# EAGLE design ble_clone (EAGLE 9.4.2)
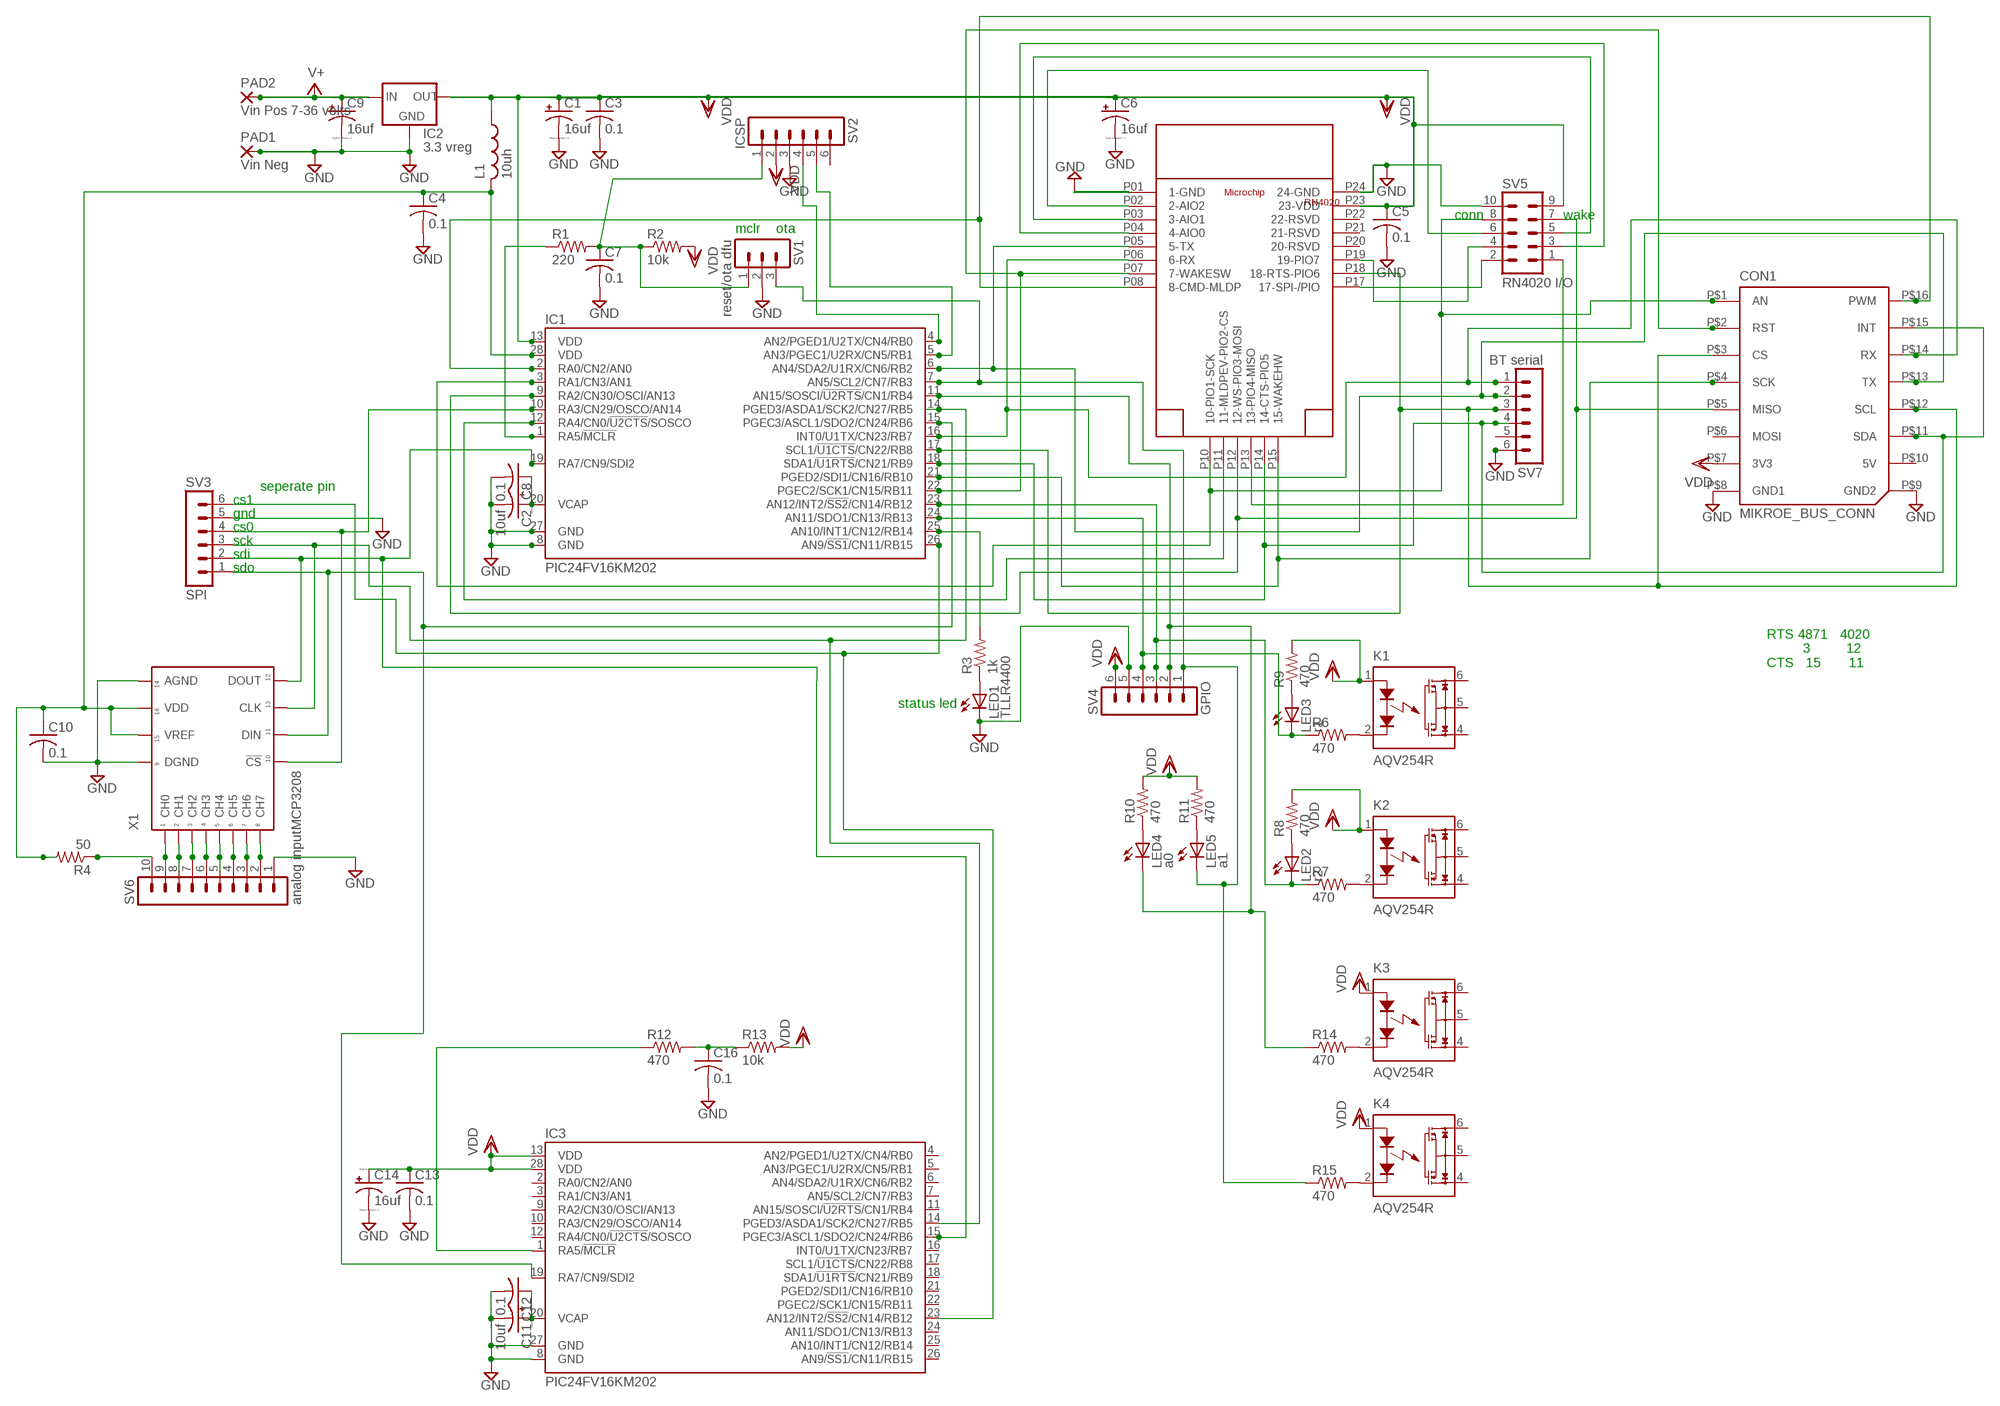
[diagram p0: schematic, sheet 1]

## Parts
C1  16uf  CPOL-USTAP5-45  [TAP5-45]
C2  10uf  CPOL-USTAP5-45  [TAP5-45]
C3  0.1  C-US025-024X044  [C025-024X044]
C4  0.1  C-US025-024X044  [C025-024X044]
C5  0.1  C-US025-024X044  [C025-024X044]
C6  16uf  CPOL-USTAP5-45  [TAP5-45]
C7  0.1  C-US025-024X044  [C025-024X044]
C8  0.1  C-US025-024X044  [C025-024X044]
C9  16uf  CPOL-USTAP5-45  [TAP5-45]
C10  0.1  C-US025-024X044  [C025-024X044]
C11  10uf  CPOL-USTAP5-45  [TAP5-45]
C12  0.1  C-USC0805  [C0805]
C13  0.1  C-USC0805  [C0805]
C14  16uf  CPOL-USTAP5-45  [TAP5-45]
C16  0.1  C-USC0805  [C0805]
CON1  MIKROE_BUS_CONN  [MIKROBUS_HOST_CONN]
IC1  PIC24FV16KM202  PIC24FVXXKA302-SP  [DIL28-3]
IC2  3.3 vreg  78XXL  [78XXL]
IC3  PIC24FV16KM202  PIC24FVXXKA302-SP  [DIL28-3]
K1  AQV254R  [DIL06]
K2  AQV254R  [DIL06]
K3  AQV254R  [DIL06]
K4  AQV254R  [DIL06]
L1  10uh  L-US0204/5  [0204/5]
LED1  TLLR4400  [LED3MM]
LED2  r2  LED3MM  [LED3MM]
LED3  r1  LED3MM  [LED3MM]
LED4  a0  LED3MM  [LED3MM]
LED5  a1  LED3MM  [LED3MM]
PAD1  Vin Neg  2,54/1,0  [2,54/1,0]
PAD2  Vin Pos 7-36 volts  2,54/1,0  [2,54/1,0]
R1  220  R-US_0204/2V  [0204V]
R2  10k  R-US_0204/2V  [0204V]
R3  1k  R-US_0204/2V  [0204V]
R4  50  R-US_0204/2V  [0204V]
R6  470  R-US_0204/2V  [0204V]
R7  470  R-US_0204/2V  [0204V]
R8  470  R-US_0204/2V  [0204V]
R9  470  R-US_0204/2V  [0204V]
R10  470  R-US_0204/2V  [0204V]
R11  470  R-US_0204/2V  [0204V]
R12  470  R-US_0204/2V  [0204V]
R13  10k  R-US_0204/2V  [0204V]
R14  470  R-US_0204/2V  [0204V]
R15  470  R-US_0204/2V  [0204V]
SV1  reset/ota dfu  MA03-1  [MA03-1]
SV2  ICSP  MA06-1  [MA06-1]
SV3  SPI  MA06-1  [MA06-1]
SV4  GPIO  MA06-1  [MA06-1]
SV5  RN4020 I/O  MA05-2  [MA05-2]
SV6  analog input  MA10-1  [MA10-1]
SV7  BT serial  MA06-1  [MA06-1]
U$1  RN4020  [RN4020SMD]
X1  MCP3208  21298EDIP  [DIP16]

## Nets
GND: C1.- C2.- C3.2 C4.2 C5.2 C6.- C7.2 C8.2 C9.- C10.2 C11.- C12.2 C13.2 C14.- C16.2 CON1.P$8(GND1) CON1.P$9(GND2) IC1.8(GND) IC1.27(GND) IC2.GND IC3.8(GND) IC3.27(GND) LED1.K(C) PAD1.1(P) SV1.2 SV2.3 SV3.5 SV4.5 SV5.10 SV6.1 SV7.6 U$1.P01(1-GND) U$1.P24(24-GND) X1.P$9(DGND) X1.P$14(AGND)
N$1: CON1.P$16(PWM) IC1.2(RA0/CN2/AN0) U$1.P08(8-CMD-MLDP)
N$2: C7.1 R1.2 R2.1 SV1.1 SV2.1
N$3: CON1.P$13(TX) IC1.6(AN4/SDA2/U1RX/CN6/RB2) SV7.2 U$1.P05(5-TX)
N$4: CON1.P$14(RX) IC1.16(INT0/U1TX/CN23/RB7) SV7.1 U$1.P06(6-RX)
N$5: CON1.P$2(RST) IC1.22(PGEC2/SCK1/CN15/RB11) U$1.P07(7-WAKESW)
N$6: IC1.1(RA5/!MCLR) R1.1
N$7: IC1.7(AN5/SCL2/CN7/RB3) LED5.K(C) R15.1 SV1.3 SV4.1
N$8: IC1.4(AN2/PGED1/U2TX/CN4/RB0) SV2.4
N$9: CON1.P$3(CS) CON1.P$12(SCL) IC1.17(SCL1/!U1CTS!/CN22/RB8) SV7.3 U$1.P18(18-RTS-PIO6)
N$10: CON1.P$11(SDA) CON1.P$15(INT) IC1.18(SDA1/!U1RTS!/CN21/RB9) SV7.4 U$1.P14(14-CTS-PIO5)
N$11: CON1.P$4(SCK) IC1.21(PGED2/SDI1/CN16/RB10) U$1.P15(15-WAKEHW)
N$12: CON1.P$5(MISO) IC1.9(RA2/CN30/OSCI/AN13) SV5.7 U$1.P12(12-WS-PIO3-MOSI)
N$13: CON1.P$1(AN) IC1.3(RA1/CN3/AN1) SV5.8 U$1.P10(10-PIO1-SCK)
N$14: IC1.12(RA4/CN0/!U2CTS!/SOSCO) U$1.P11(11-MLDPEV-PIO2-CS)
N$15: IC1.5(AN3/PGEC1/U2RX/CN5/RB1) SV2.5
N$16: C4.1 C10.1 IC1.28(VDD) L1.2 R4.2 X1.P$15(VREF) X1.P$16(VDD)
N$17: C2.+ C8.1 IC1.20(VCAP)
N$18: IC1.10(RA3/CN29/OSCO/AN14) SV3.4 X1.P$10(!CS)
N$19: IC1.19(RA7/CN9/SDI2) IC3.15(PGEC3/ASCL1/SDO2/CN24/RB6) SV3.2 X1.P$12(DOUT)
N$20: IC1.15(PGEC3/ASCL1/SDO2/CN24/RB6) IC3.19(RA7/CN9/SDI2) SV3.1 X1.P$11(DIN)
N$21: IC1.14(PGED3/ASDA1/SCK2/CN27/RB5) IC3.14(PGED3/ASDA1/SCK2/CN27/RB5) SV3.3 X1.P$13(CLK)
N$22: IC1.25(AN10/INT1/CN12/RB14) R3.2
N$23: IC1.26(AN9/!SS1!/CN11/RB15) IC3.23(AN12/INT2/!SS2!/CN14/RB12) SV3.6
N$24: IC1.11(AN15/SOSCI/!U2RTS!/CN1/RB4) LED4.K(C) R14.1 SV4.2
N$25: IC1.23(AN12/INT2/!SS2!/CN14/RB12) LED2.K(C) R7.1 SV4.3
N$26: IC1.24(AN11/SDO1/CN13/RB13) LED3.K(C) R6.1 SV4.4
N$27: LED1.A R3.1
N$28: SV5.1 U$1.P13(13-PIO4-MISO)
N$29: SV5.2 U$1.P17(17-SPI-/PIO)
N$30: SV5.4 U$1.P19(19-PIO7)
N$31: SV5.3 U$1.P04(4-AIO0)
N$32: SV5.5 U$1.P03(3-AIO1)
N$33: SV5.6 U$1.P02(2-AIO2)
N$34: SV6.2 X1.P$8(CH7)
N$35: SV6.3 X1.P$7(CH6)
N$36: SV6.4 X1.P$6(CH5)
N$37: SV6.5 X1.P$5(CH4)
N$38: SV6.6 X1.P$4(CH3)
N$39: SV6.7 X1.P$3(CH2)
N$40: SV6.8 X1.P$2(CH1)
N$41: SV6.9 X1.P$1(CH0)
N$42: C11.+ C12.1 IC3.20(VCAP)
N$43: R4.1 SV6.10
N$44: K3.2(K) R14.2
N$45: K1.2(K) R6.2
N$46: K2.2(K) R7.2
N$47: LED2.A R8.1
N$48: LED3.A R9.1
N$49: C16.1 R12.2 R13.1
N$50: IC3.1(RA5/!MCLR) R12.1
N$51: LED4.A R10.1
N$52: LED5.A R11.1
N$53: K4.2(K) R15.2
V+: C9.+ IC2.IN PAD2.1(P)
VDD: C1.+ C3.1 C5.1 C6.+ C13.1 C14.+ CON1.P$7(3V3) IC1.13(VDD) IC2.OUT IC3.13(VDD) IC3.28(VDD) K1.1(A) K2.1(A) K3.1(A) K4.1(A) L1.1 R2.2 R8.2 R9.2 R10.2 R11.2 R13.2 SV2.2 SV4.6 SV5.9 U$1.P23(23-VDD)
Unconnected: CON1.P$6(MOSI) CON1.P$10(5V) IC3.2(RA0/CN2/AN0) IC3.3(RA1/CN3/AN1) IC3.4(AN2/PGED1/U2TX/CN4/RB0) IC3.5(AN3/PGEC1/U2RX/CN5/RB1) IC3.6(AN4/SDA2/U1RX/CN6/RB2) IC3.7(AN5/SCL2/CN7/RB3) IC3.9(RA2/CN30/OSCI/AN13) IC3.10(RA3/CN29/OSCO/AN14) IC3.11(AN15/SOSCI/!U2RTS!/CN1/RB4) IC3.12(RA4/CN0/!U2CTS!/SOSCO) IC3.16(INT0/U1TX/CN23/RB7) IC3.17(SCL1/!U1CTS!/CN22/RB8) IC3.18(SDA1/!U1RTS!/CN21/RB9) IC3.21(PGED2/SDI1/CN16/RB10) IC3.22(PGEC2/SCK1/CN15/RB11) IC3.24(AN11/SDO1/CN13/RB13) IC3.25(AN10/INT1/CN12/RB14) IC3.26(AN9/!SS1!/CN11/RB15) K1.4(D2) K1.5(S) K1.6(D1) K2.4(D2) K2.5(S) K2.6(D1) K3.4(D2) K3.5(S) K3.6(D1) K4.4(D2) K4.5(S) K4.6(D1) SV2.6 SV7.5 U$1.P20(20-RSVD) U$1.P21(21-RSVD) U$1.P22(22-RSVD)

## Notes on the sheet
- conn | wake
- mclr | ota
- seperate pin
- cs1
- gnd
- cs0
- sck
- sdi
- sdo
- RTS 4871   4020
           3         12
  CTS   15       11
- status led

## Library data of the parts
C1 C2 C6 C9 C11 C14 = resistor:CPOL-US: POLARIZED CAPACITOR, American symbol
C3-C5 C7 C8 C10 = resistor:C-US: CAPACITOR, American symbol
C12 C13 C16 = rcl:C-US: CAPACITOR, American symbol; SPICEPREFIX: C
CON1 = mikrobus_lib:MIKROE_BUS_CONN
IC1 IC3 = pic24kakl:PIC24FVXXKA302: PIC24FVXXKA302 2.0-5.5V 28 pin
IC2 = v-reg:78XXL: VOLTAGE REGULATOR
K1-K4 = relay:AQV254R: PhotoMOS Relay NAiS Source: http://www.mew-europe.com/.. pti_en.pdf; MF: AROMAT/ MATSUSHITA; MPN: AQV254; OC_FARNELL: 1124063; OC_NEWARK: 93F6300
L1 = resistor:L-US: INDUCTOR, American symbol
LED1 = led:TLLR4400: Low Current (2mA) LED 3 mm Tinted Diffused Package color RED Source: Data sheet <http://www.farnell.com/datasheets/391100.pdf>; MF: VISHAY SEMICONDUCTOR; OC_FARNELL: 1612437
LED2-LED5 = led:LED: LED OSRAM: - CHIPLED LG R971, LG N971, LY N971, LG Q971, LY Q971, LO R971, LY R971 LH N974, LH R974 LS Q976, LO Q976, LY Q976 LO Q996 - Hyper CHIPLED LW Q18S LB Q993, LB Q99A, LB R99A - SideLED LS A670, LO A670, LY A670, LG A670, LP A670 LB A673, LV A673, LT A673, LW A673 LH A674 LY A675 LS A676, LA A676, LO A676, LY A676, LW A676 LS A679, LY A679, LG A679 - Hyper Micro SIDELED® LS Y876, LA Y876, LO Y876, LY Y876 LT Y87S - SmartLED LW L88C, LW L88S LB L89C, LB L89S, LG L890 LS L89K, LO L89K, LY L89K LS L896, LA L896, LO L896, LY L896 - TOPLED LS T670, LO T670, LY T670, LG T670, LP T670 LSG T670, LSP T670, LSY T670, LOP T670, LYG T670 LG T671, LOG T671, LSG T671 LB T673, LV T673, LT T673, LW T673 LH T674 LS T676, LA T676, LO T676, LY T676, LB T676, LH T676, LSB T676, LW T676 LB T67C, LV T67C, LT T67C, LS T67K, LO T67K, LY T67K, LW E67C LS E67B, LA E67B, LO E67B, LY E67B, LB E67C, LV E67C, LT E67C LW T67C LS T679, LY T679, LG T679 LS T770, LO T770, LY T770, LG T770, LP T770 LB T773, LV T773, LT T773, LW T773 LH T774 LS E675, LA E675, LY E675, LS T675 LS T776, LA T776, LO T776, LY T776, LB T776 LHGB T686 LT T68C, LB T68C - Hyper Mini TOPLED® LB M676 - Mini TOPLED Santana® LG M470 LS M47K, LO M47K, LY M47K Source: http://www.osram.convergy.de LUXEON: - LUMILED® LXK2-PW12-R00, LXK2-PW12-S00, LXK2-PW14-U00, LXK2-PW14-V00 LXK2-PM12-R00, LXK2-PM12-S00, LXK2-PM14-U00 LXK2-PE12-Q00, LXK2-PE12-R00, LXK2-PE12-S00, LXK2-PE14-T00, LXK2-PE14-U00 LXK2-PB12-K00, LXK2-PB12-L00, LXK2-PB12-M00, LXK2-PB14-N00, LXK2-PB14-P00, LXK2-PB14-Q00 LXK2-PR12-L00, LXK2-PR12-M00, LXK2-PR14-Q00, LXK2-PR14-R00 LXK2-PD12-Q00, LXK2-PD12-R00, LXK2-PD12-S00 LXK2-PH12-R00, LXK2-PH12-S00 LXK2-PL12-P00, LXK2-PL12-Q00, LXK2-PL12-R00 Source: www.luxeon.com KINGBRIGHT: KA-3528ASYC Source: www.kingbright.com
PAD1 PAD2 = wirepad:2,54/1,0: THROUGH-HOLE PAD
R1-R4 R6-R15 = resistor:R-US_: RESISTOR, American symbol
SV1 = con-lstb:MA03-1: PIN HEADER; OC_FARNELL: unknown; OC_NEWARK: unknown
SV2-SV4 SV7 = con-lstb:MA06-1: PIN HEADER; OC_FARNELL: unknown; OC_NEWARK: unknown
SV5 = con-lstb:MA05-2: PIN HEADER; OC_FARNELL: unknown; OC_NEWARK: unknown
SV6 = con-lstb:MA10-1: PIN HEADER; OC_FARNELL: unknown; OC_NEWARK: unknown
U$1 = microchip_bluetooth_v101:RN4020
X1 = Microchip:21298E

## Board
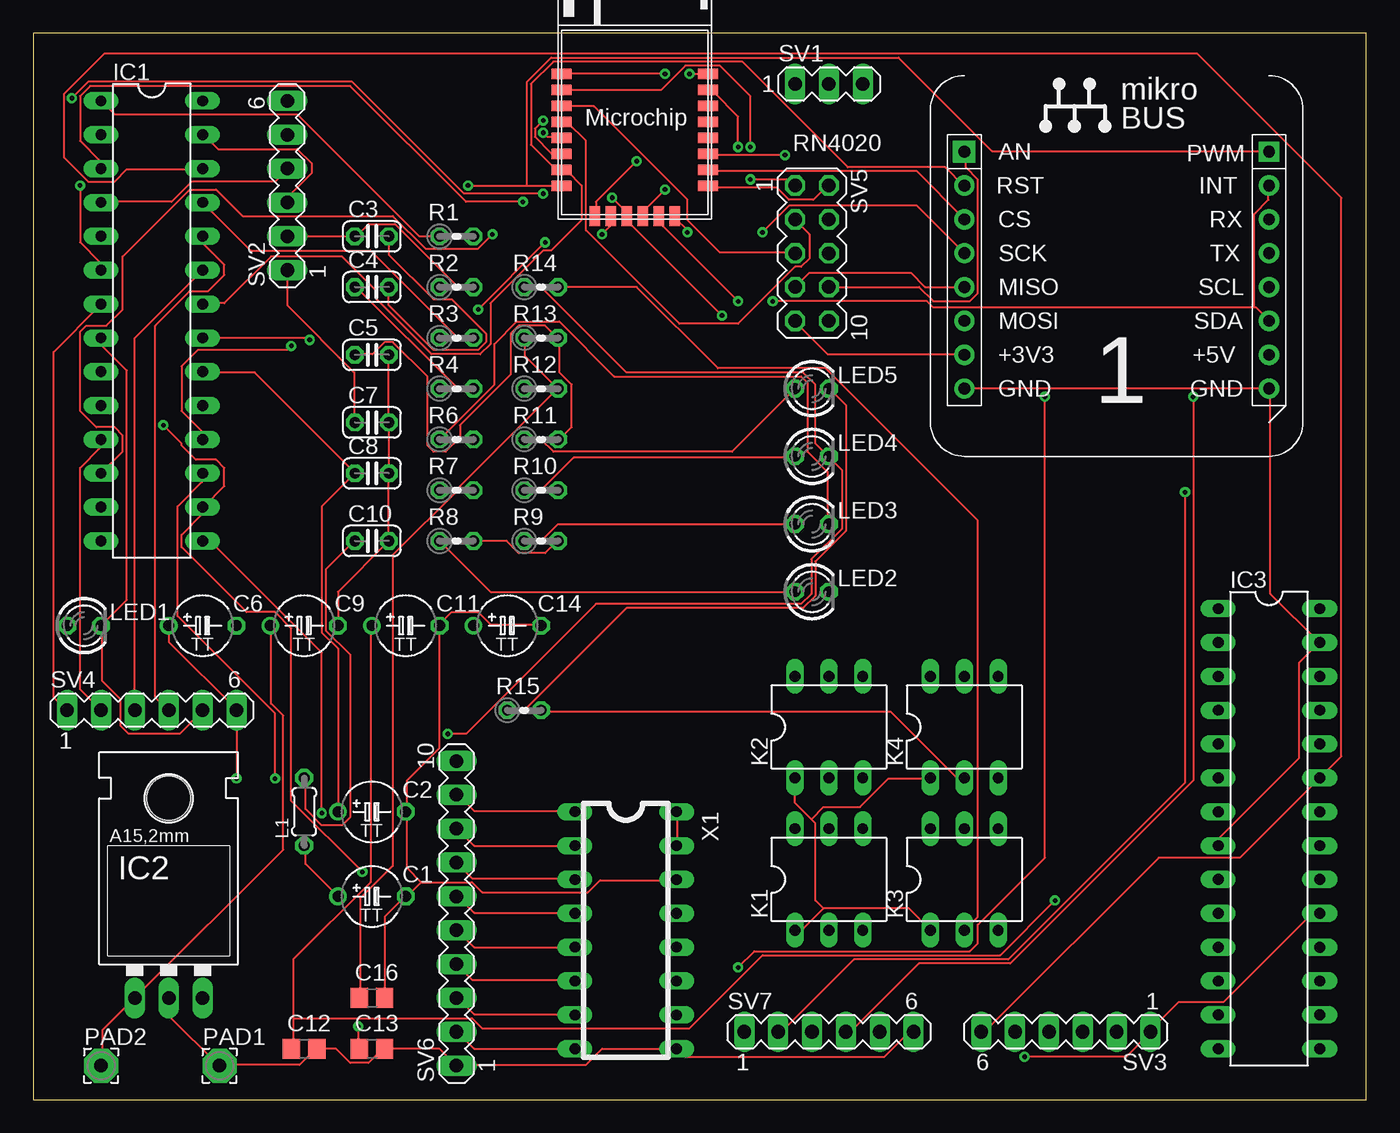
[diagram p1: board, top side]
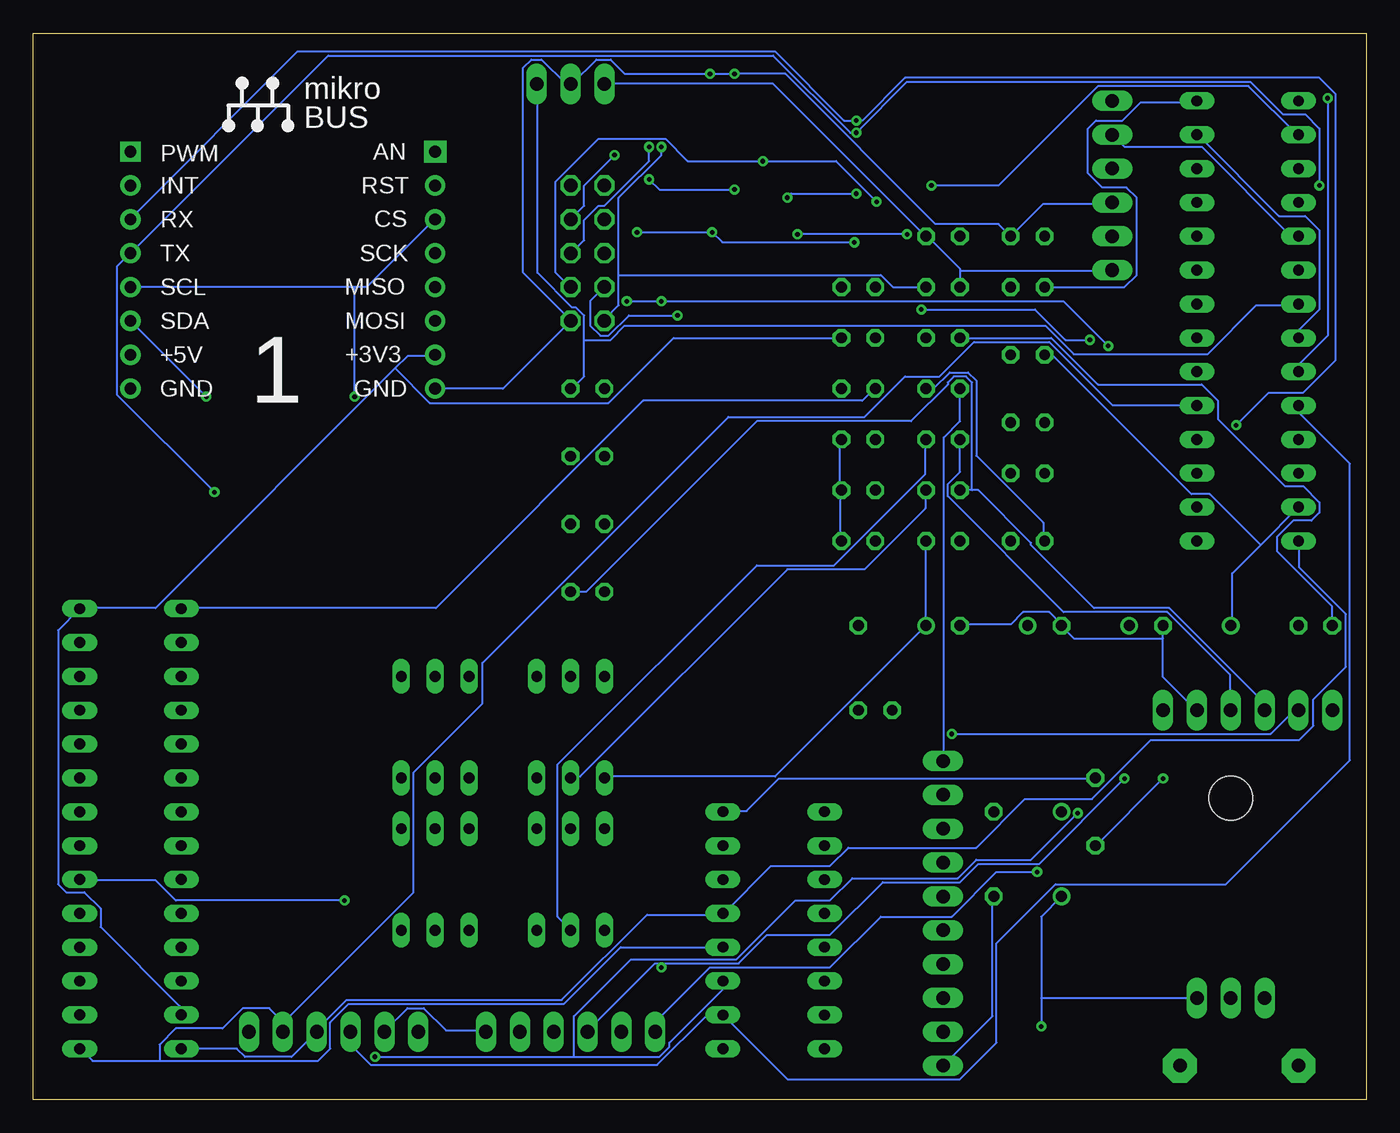
[diagram p2: board, bottom side, seen from below]

Size 100 x 80 mm. Coordinates in mm from the lower left corner, seen from the top.
Outline: 0,0 100,0 100,80 0,80 0,0
Copper layers (1*16): Top 0.035mm / dielectric 1.5mm / Bottom 0.035mm
Design rules "default": minimum track width 6mil, minimum drill 0.35mm, track to track 6mil, track to pad 6mil, pad to pad 6mil, via to via 6mil, smd to smd 6mil, copper to edge 40mil, drill to drill 6mil, minimum pad ring 10mil, minimum via ring 8mil, stop-mask expansion 4mil, vias tented up to drill 0mil, thermal gap 10mil

### Footprints (pad centres in the part's own frame; a part is rotated, then mirrored left to right if it is on the bottom)
TAP5-45 = drill 0.813: + -2.54,0 | drill 0.813 octagon: - 2.54,0
C025-024X044 = drill 0.813 octagon: 1 -1.27,0; 2 1.27,0
C0805 = smd 1.3 x 1.5: 1 -0.95,0; 2 0.95,0
MIKROBUS_HOST_CONN = drill 0.889 pad 1.676 square: P$1 0,0 | drill 0.889 pad 1.524: P$2 0,-2.54; P$3 0,-5.08; P$4 0,-7.62; P$5 0,-10.16; P$6 0,-12.7; P$7 0,-15.24; P$8 0,-17.78; P$9 22.86,-17.78; P$10 22.86,-15.24; P$11 22.86,-12.7; P$12 22.86,-10.16; P$13 22.86,-7.62; P$14 22.86,-5.08; P$15 22.86,-2.54 | drill 0.889 pad 1.524 square: P$16 22.86,0
DIL28-3 = drill 0.813 long: 1 -16.51,-3.81; 2 -13.97,-3.81; 3 -11.43,-3.81; 4 -8.89,-3.81; 5 -6.35,-3.81; 6 -3.81,-3.81; 7 -1.27,-3.81; 8 1.27,-3.81; 9 3.81,-3.81; 10 6.35,-3.81; 11 8.89,-3.81; 12 11.43,-3.81; 13 13.97,-3.81; 14 16.51,-3.81; 15 16.51,3.81; 16 13.97,3.81; 17 11.43,3.81; 18 8.89,3.81; 19 6.35,3.81; 20 3.81,3.81; 21 1.27,3.81; 22 -1.27,3.81; 23 -3.81,3.81; 24 -6.35,3.81; 25 -8.89,3.81; 26 -11.43,3.81; 27 -13.97,3.81; 28 -16.51,3.81
78XXL = drill 1.016 long: GND 0,-3.81; IN -2.54,-3.81; OUT 2.54,-3.81 | hole 3.302: 0,11.176
DIL06 = drill 0.813 long: 1 -2.54,-3.81; 2 0,-3.81; 3 2.54,-3.81; 4 2.54,3.81; 5 0,3.81; 6 -2.54,3.81
0204/5 = drill 0.813 octagon: 1 -2.54,0; 2 2.54,0
LED3MM = drill 0.813 octagon: A -1.27,0; K 1.27,0
2,54/1,0 = drill 1.016 pad 2.54 octagon: 1 0,0
0204V = drill 0.813 octagon: 1 -1.27,0; 2 1.27,0
MA03-1 = drill 1.016 long: 1 -2.54,0; 2 0,0; 3 2.54,0
MA06-1 = drill 1.016 long: 1 -6.35,0; 2 -3.81,0; 3 -1.27,0; 4 1.27,0; 5 3.81,0; 6 6.35,0
MA05-2 = drill 1.016 octagon: 1 -5.08,-1.27; 2 -5.08,1.27; 3 -2.54,-1.27; 4 -2.54,1.27; 5 0,-1.27; 6 0,1.27; 7 2.54,-1.27; 8 2.54,1.27; 9 5.08,-1.27; 10 5.08,1.27
MA10-1 = drill 1.016 long: 1 -11.43,0; 2 -8.89,0; 3 -6.35,0; 4 -3.81,0; 5 -1.27,0; 6 1.27,0; 7 3.81,0; 8 6.35,0; 9 8.89,0; 10 11.43,0
RN4020SMD = smd 1.5 x 0.8: P01 0.25,10.9; P02 0.25,9.7; P03 0.25,8.5; P04 0.25,7.3; P05 0.25,6.1; P06 0.25,4.9; P07 0.25,3.7; P08 0.25,2.5; P17 11.25,2.5; P18 11.25,3.7; P19 11.25,4.9; P20 11.25,6.1; P21 11.25,7.3; P22 11.25,8.5; P23 11.25,9.7; P24 11.25,10.9 | smd 0.8 x 1.5: P10 2.75,0.25; P11 3.95,0.25; P12 5.15,0.25; P13 6.35,0.25; P14 7.55,0.25; P15 8.75,0.25
DIP16 = drill 0.8 long: P$1 -10.16,-3.81; P$2 -7.62,-3.81; P$3 -5.08,-3.81; P$4 -2.54,-3.81; P$5 0,-3.81; P$6 2.54,-3.81; P$7 5.08,-3.81; P$8 7.62,-3.81; P$9 7.62,3.81; P$10 5.08,3.81; P$11 2.54,3.81; P$12 0,3.81; P$13 -2.54,3.81; P$14 -5.08,3.81; P$15 -7.62,3.81; P$16 -10.16,3.81

### Placement (x,y rotation side)
C1  25.4,15.24 0 top
C2  25.4,21.59 0 top
C3  25.4,64.77 0 top
C4  25.4,60.96 0 top
C5  25.4,55.88 0 top
C6  12.7,35.56 0 top
C7  25.4,50.8 0 top
C8  25.4,46.99 0 top
C9  20.32,35.56 0 top
C10  25.4,41.91 0 top
C11  27.94,35.56 0 top
C12  20.32,3.81 0 top
C13  25.4,3.81 0 top
C14  35.56,35.56 0 top
C16  25.4,7.62 0 top
CON1  69.85,71.12 0 top
IC1  8.89,58.42 270 top
IC2  10.16,11.43 0 top
IC3  92.71,20.32 270 top
K1  59.69,16.51 0 top
K2  59.69,27.94 0 top
K3  69.85,16.51 0 top
K4  69.85,27.94 0 top
L1  20.32,21.59 90 top
LED1  3.81,35.56 0 top
LED2  58.42,38.1 0 top
LED3  58.42,43.18 0 top
LED4  58.42,48.26 0 top
LED5  58.42,53.34 0 top
PAD1  13.97,2.54 0 top
PAD2  5.08,2.54 0 top
R1  31.75,64.77 0 top
R2  31.75,60.96 0 top
R3  31.75,57.15 0 top
R4  31.75,53.34 0 top
R6  31.75,49.53 0 top
R7  31.75,45.72 0 top
R8  31.75,41.91 0 top
R9  38.1,41.91 0 top
R10  38.1,45.72 0 top
R11  38.1,49.53 0 top
R12  38.1,53.34 0 top
R13  38.1,57.15 0 top
R14  38.1,60.96 0 top
R15  36.83,29.21 0 top
SV1  59.69,76.2 0 top
SV2  19.05,68.58 90 top
SV3  77.47,5.08 180 top
SV4  8.89,29.21 0 top
SV5  58.42,63.5 270 top
SV6  31.75,13.97 90 top
SV7  59.69,5.08 0 top
U$1  39.37,66.04 0 top
X1  44.45,11.43 270 top

### Tracks (layer width: path | path; a pad name or v marks a point on that pad's centre or on a via)
GND  (via drill 0.35)
  Top 0.152: v47.4,76.96 39.62,76.96 U$1.P01 | v49.23,76.96 50.6,76.96 U$1.P24 | 96.47,34.29 94.94,32.77 94.94,25.6 89,19.66 89,19.05 IC3.8 | 96.47,34.29 92.81,37.95 92.81,53.34 CON1.P$9 CON1.P$8 | 96.47,34.29 IC3.27 | C4.2 26.67,59.59 30.02,56.24 33.38,56.24 33.98,56.84 33.98,57.45 31.39,60.05 30.02,60.05 26.67,63.4 C3.2 | SV2.3 19.05,67.67 20.88,69.49 20.88,70.26 19.81,71.32 13.87,71.32 12.8,72.39 IC1.27 | SV4.5 12.65,29.11 10.97,27.43 7.16,27.43 6.55,28.04 6.55,30.02 5.18,31.39 5.18,35.51 LED1.K 7.01,37.49 7.01,54.71 5.18,56.54 5.18,57.15 IC1.8 | C5.2 C7.2 C8.2 C10.2 22.86,38.1 C9.- | C14.- 38.1,35.66 34.29,35.66 33.38,36.58 31.39,36.58 30.48,35.66 C11.- 30.48,26.36 28.04,23.93 28.04,21.64 C2.- 28.04,21.49 28.04,17.37 29.11,16.31 | C16.2 26.36,7.62 26.36,13.72 27.89,15.24 C1.- 28.04,15.24 29.11,16.31 | 29.11,16.31 32.92,16.31 33.68,15.54 41.6,15.54 42.52,16.46 48.16,16.46 X1.P$14 | IC2.GND 10.21,7.62 10.21,6.25 13.87,2.59 PAD1.1 14.02,2.59 19.96,2.59 21.18,3.81 C12.2 22.71,3.81 23.77,2.74 25.15,2.74 26.21,3.81 C13.2 30.48,3.81 SV6.1 31.85,2.59 41.45,2.59 42.67,3.81 X1.P$9 48.31,3.81 48.92,3.2 63.86,3.2 65.68,5.03 65.99,5.03 SV7.6
  Bottom 0.152: CON1.P$8 64.77,53.34 SV5.10 59.74,58.52 63.25,62.03 63.25,77.42 62.64,78.03 61.87,78.03 60.05,76.2 SV1.2 59.59,76.2 57.76,78.03 56.69,78.03 55.63,76.96 v49.23,76.96 v47.4,76.96 43.59,76.96 32.31,65.68 27.58,65.68 C3.2 24.23,67.21 19.05,67.21 SV2.3 | IC1.8 5.03,57.15 5.03,57.76 3.5,59.28 3.5,65.23 4.57,66.29 6.55,66.29 12.65,72.39 IC1.27 | 15.24,34.59 15.24,31.7 12.8,29.26 SV4.5 | 15.24,34.59 C6.- | C11.- 30.48,35.66 26.67,35.66 25.76,36.58 23.77,36.58 22.86,35.66 C9.- 22.86,35.51 21.95,34.59 15.24,34.59 | SV7.6 66.14,5.18 69.04,5.18 70.71,6.86 71.93,6.86 73.61,5.18 SV3.5 | SV6.1 28.04,6.25 28.04,15.24 C1.-
N$1  (via drill 0.35)
  Top 0.152: v32.61,68.58 37.03,68.58 | 37.03,68.58 39.47,68.58 U$1.P08 | 37.03,68.58 37.03,76.35 38.86,78.18 64.92,78.18 71.93,71.17 92.66,71.17 CON1.P$16
  Bottom 0.152: v32.61,68.58 27.58,68.58 20.12,76.05 8.84,76.05 5.18,72.39 IC1.2
N$2
  Top 0.152: SV2.1 19.05,59.59 24.08,54.56 24.08,50.9 C7.1
  Bottom 0.152: 30.48,62.18 30.48,62.33 32.92,64.77 R1.2 33.07,64.77 44.5,76.2 SV1.1 | 30.48,62.18 R2.1 | 30.48,62.18 19.05,62.18 SV2.1
N$3  (via drill 0.35)
  Top 0.152: v38.25,72.54 38.56,72.24 39.47,72.24 U$1.P05 | v3.5,68.58 3.5,64.31 5.03,62.79 5.03,62.33 IC1.6 | v86.41,45.57 86.41,23.77 73.15,10.52 61.57,10.52 56.24,5.18 55.93,5.18 SV7.2
  Bottom 0.152: v3.5,68.58 3.5,72.85 4.57,73.91 6.25,73.91 8.69,76.35 34.44,76.35 v38.25,72.54 38.71,72.54 44.5,78.33 77.88,78.33 CON1.P$13 93.73,62.48 93.73,52.88 v86.41,45.57
N$4  (via drill 0.35)
  Top 0.152: v38.25,73.46 37.64,72.85 37.64,72.24 38.86,71.02 39.47,71.02 U$1.P06 | v24.69,17.07 19.36,22.4 19.36,35.36 18.14,36.58 16,36.58 11.12,41.45 11.12,42.37 12.65,43.89 12.65,44.35 IC1.16 12.8,44.5 14.33,46.02 14.33,47.4 13.72,48.01 12.19,48.01 11.12,49.07 11.12,49.23 v9.75,50.6
  Bottom 0.152: CON1.P$14 92.66,66.14 80.16,78.64 44.35,78.64 39.17,73.46 v38.25,73.46 37.8,73.46 34.59,76.66 3.5,76.66 2.29,75.44 2.29,55.47 4.72,53.03 7.32,53.03 v9.75,50.6 | v24.69,17.07 27.74,17.07 31.09,13.72 36.42,13.72 40.23,9.91 49.23,9.91 53.34,5.79 SV7.1
N$5
  Top 0.152: CON1.P$2 69.8,68.58 68.43,69.95 61.11,69.95 53.19,77.88 39.01,77.88 37.34,76.2 37.34,71.63 39.17,69.8 39.47,69.8 U$1.P07 39.62,69.65 40.08,69.65 41.15,68.58 41.15,65.99 38.86,63.7 38.25,63.7 34.29,59.74 34.29,56.69 33.53,55.93 29.87,55.93 25.76,60.05 25.76,60.66 23.16,63.25 17.83,63.25 14.33,59.74 12.8,59.74 IC1.22
N$6
  Top 0.152: R1.1 28.96,64.77 19.81,73.91 6.1,73.91 IC1.1
N$7
  Top 0.152: IC1.7 5.03,59.59 1.52,56.08 1.52,30.18 2.44,29.26 SV4.1 | R15.1 35.66,29.26 36.88,29.26 44.5,36.88 57.76,36.88 58.67,37.8 58.67,40.39 60.96,42.67 60.96,52.12 59.74,53.34 LED5.K
  Bottom 0.152: 58.67,57 58.67,54.25 59.59,53.34 LED5.K | 58.67,57 58.67,58.83 59.28,59.44 59.59,59.44 62.18,62.03 62.18,76.2 SV1.3 | 58.67,57 56.69,57 55.63,58.06 24.08,58.06 21.95,55.93 11.89,55.93 8.23,59.59 5.18,59.59 IC1.7
N$8
  Top 0.152: IC1.4 5.18,67.36 10.36,67.36 11.89,68.89 18.14,68.89 19.05,69.8 SV2.4
N$9  (via drill 0.35)
  Top 0.152: U$1.P18 50.75,69.65 66.29,69.65 69.8,66.14 CON1.P$3 | v18.14,24.08 18.14,28.96 10.82,36.27 10.82,44.5 12.65,46.33 12.65,46.94 IC1.17 | v75.89,52.73 75.89,18.14 70.87,13.11 70.87,11.73 70.26,11.12 54.1,11.12 v52.88,9.91
  Bottom 0.152: 75.89,60.96 74.98,60.96 69.95,65.99 CON1.P$3 | 75.89,60.96 CON1.P$12 | v18.14,24.08 24.54,17.68 29.11,17.68 30.48,16.31 36.27,16.31 40.23,12.34 44.96,12.34 47.09,10.21 52.88,10.21 | 52.88,10.21 53.34,10.21 58.37,5.18 SV7.3 | v75.89,52.73 75.89,60.96 | 52.88,10.21 v52.88,9.91
N$10  (via drill 0.35)
  Top 0.152: v52.88,59.89 46.94,65.84 46.94,66.14 U$1.P14 | v55.47,59.89 67.06,59.89 67.51,59.44 91.59,59.44 | 91.59,59.44 91.75,59.44 92.66,58.52 CON1.P$11 | v19.36,56.54 19.05,56.24 12.34,56.24 11.12,55.02 11.12,51.66 12.65,50.14 12.65,49.53 IC1.18 | v87.02,52.73 87.02,23.93 73.3,10.21 66.45,10.21 61.42,5.18 60.96,5.18 SV7.4 | 91.59,59.44 91.59,66.45 92.66,67.51 92.66,68.58 CON1.P$15
  Bottom 0.152: v55.47,59.89 v52.88,59.89 22.71,59.89 v19.36,56.54 | CON1.P$11 v87.02,52.73
N$11  (via drill 0.35)
  Top 0.152: v49.07,65.08 49.07,65.23 48.16,66.14 U$1.P15 | v54.71,65.08 56.69,67.06 66.29,67.06 CON1.P$4 | IC1.21 20.57,57.15 v20.73,57 | v38.41,64.31 v33.38,59.28
  Bottom 0.152: v54.71,65.08 v49.07,65.08 48.31,64.31 v38.41,64.31 | v20.73,57 22.55,57 24.84,59.28 v33.38,59.28
N$12  (via drill 0.35)
  Top 0.152: v51.66,58.83 44.65,65.84 44.65,66.14 U$1.P12 44.5,66.29 44.5,66.6 v43.43,67.67 | v2.9,75.13 4.12,76.35 23.93,76.35 32.31,67.97 v38.25,67.97 | CON1.P$5 66.9,60.96 65.84,62.03 58.22,62.03 SV5.7
  Bottom 0.152: v51.66,58.83 55.32,58.83 56.84,57.3 57.45,57.3 58.22,58.06 58.22,59.89 SV5.7 | v2.9,75.13 2.9,57.3 5.03,55.17 5.03,54.71 IC1.9 | v38.25,67.97 43.13,67.97 v43.43,67.67
N$13  (via drill 0.35)
  Top 0.152: v45.26,70.41 42.22,67.36 42.22,66.29 U$1.P10 | v36.73,67.36 32.46,67.36 23.77,76.05 4.27,76.05 3.5,75.29 3.5,71.93 5.03,70.41 5.03,69.95 IC1.3 | SV5.8 66.45,60.96 67.51,59.89 70.26,59.89 70.87,60.5 70.87,69.04 69.95,69.95 69.95,71.02 CON1.P$1
  Bottom 0.152: SV5.8 59.74,60.96 60.81,62.03 60.81,68.89 57.61,72.08 52.58,72.08 50.9,70.41 v45.26,70.41 39.78,70.41 v36.73,67.36
N$14  (via drill 0.35)
  Top 0.152: v42.67,64.92 43.28,65.53 43.28,66.14 U$1.P11 | v34.44,64.92 33.38,63.86 29.41,63.86 26.98,66.29 15.7,66.29 13.72,68.28 11.73,68.28 6.71,63.25 6.71,59.28 5.49,58.06 3.96,58.06 3.5,57.61 3.5,51.66 4.72,50.44 6.1,50.44 6.71,49.84 6.71,48.62 IC1.12
  Bottom 0.152: v34.44,64.92 v42.67,64.92
N$15
  Bottom 0.152: IC1.5 5.64,64.77 12.34,71.48 18.14,71.48 SV2.5
N$16
  Top 0.152: X1.P$15 48.31,19.05 48.31,21.49 X1.P$16 | R4.2 31.85,53.34 24.23,60.96 C4.1 | L1.2 20.42,24.08 20.42,21.79 21.64,20.57 23.16,20.57 23.77,21.18 23.77,33.38 21.95,35.2 21.95,39.78 24.08,41.91 C10.1
  Bottom 0.152: L1.2 20.42,24.08 44.04,24.08 46.48,21.64 48.16,21.64 X1.P$16 | R4.2 32.46,53.34 31.24,54.56 29.87,54.56 29.26,53.95 29.26,48.31 24.23,43.28 24.23,41.91 C10.1 | C4.1 18.14,60.96 17.22,61.87 17.22,67.67 17.98,68.43 19.81,68.43 20.88,69.49 20.88,72.85 20.27,73.46 18.29,73.46 16.92,74.83 12.8,74.83 IC1.28
N$17
  Top 0.152: IC1.20 12.8,54.56 16.61,54.56 24.08,47.09 C8.1 21.64,44.5 21.64,35.05 22.86,33.83 C2.+
N$18
  Bottom 0.152: SV3.4 76.2,4.12 74.68,2.59 53.19,2.59 49.53,6.25 48.31,6.25 X1.P$10 43.43,1.52 30.48,1.52 27.74,4.27 27.74,11.73 23.32,16.15 10.52,16.15 1.22,25.45 1.22,47.7 5.03,51.51 5.03,51.97 IC1.10
N$19
  Bottom 0.152: X1.P$12 55.93,11.43 60.2,7.16 76.35,7.16 77.72,5.79 77.72,3.81 78.64,2.9 90.53,2.9 | 90.53,2.9 95.56,2.9 96.47,3.81 IC3.15 | 81.23,5.79 71.48,15.54 71.48,24.54 66.29,29.72 66.29,32.77 47.85,51.21 37.64,51.21 34.59,54.25 32,54.25 29.41,56.84 23.77,56.84 19.05,52.12 12.8,52.12 IC1.19 | 81.23,5.79 81.23,5.18 SV3.2 81.23,5.79 | 90.53,2.9 90.53,4.12 89.31,5.33 85.8,5.33 84.28,6.86 82.3,6.86 81.23,5.79
N$20  (via drill 0.35)
  Top 0.152: v74.37,3.2 81.99,3.2 83.82,5.03 SV3.1 83.82,5.18 85.95,7.32 89.31,7.32 95.86,13.87 96.47,13.87 IC3.19 | IC1.15 13.26,41.91 21.64,33.53 v21.64,21.49
  Bottom 0.152: v74.37,3.2 59.44,3.2 | 59.44,3.2 53.03,3.2 52.27,3.96 52.27,4.27 48.31,8.23 48.31,8.84 X1.P$11 | v21.64,21.49 25.15,17.98 29.26,17.98 30.63,16.61 38.56,16.61 40.23,14.94 42.82,14.94 47.24,10.52 55.17,10.52 59.44,6.25 59.44,3.2
N$21
  Bottom 0.152: IC3.14 84.73,3.81 84.12,3.2 80.62,3.2 SV3.3 78.79,5.18 76.5,7.47 60.35,7.47 53.95,13.87 48.31,13.87 X1.P$13 48.16,14.02 44.65,17.53 40.23,17.53 38.86,18.9 29.26,18.9 25.6,22.55 20.57,22.55 16.15,26.98 5.03,26.98 3.96,28.04 3.96,30.02 1.52,32.46 1.52,36.42 5.03,39.93 5.03,41.91 IC1.14
N$22
  Top 0.152: R3.2 31.85,57.15 25.3,63.7 16.31,63.7 IC1.25
N$23
  Top 0.152: IC1.26 12.65,69.8 7.01,69.8 6.1,68.89 4.12,68.89 2.29,70.71 2.29,75.44 5.33,78.49 87.33,78.49 98.15,67.67 98.15,25.76 IC3.23 90.53,18.14 84.43,18.14 71.48,5.18 71.17,5.18 SV3.6
N$24  (via drill 0.35)
  Top 0.152: SV4.2 3.5,30.79 3.5,47.4 5.03,48.92 5.03,49.53 IC1.11 | R14.1 38.1,60.96 44.5,54.56 57.76,54.56 58.67,53.65 58.67,49.23 59.59,48.31 LED4.K 59.74,48.16 60.66,47.24 60.66,42.82 58.37,40.54 58.37,37.95 57.61,37.19 42.22,37.19 32.46,27.43 v31.09,27.43
  Bottom 0.152: v31.09,27.43 7.16,27.43 5.49,29.11 5.18,29.11 SV4.2
N$25
  Top 0.152: IC1.23 7.62,57.15 SV4.3
  Bottom 0.152: 29.57,45.72 29.11,45.72 25.15,41.76 25.15,41.6 20.42,36.88 14.78,36.88 7.62,29.72 SV4.3 | 29.57,45.72 R7.1 | LED2.K 58.52,38.1 45.72,50.9 34.14,50.9 31.39,53.65 31.39,53.8 30.94,54.25 30.02,54.25 29.57,53.8 29.57,45.72
N$26
  Top 0.152: IC1.24 12.8,64.77 12.8,64.16 14.33,62.64 14.33,61.87 13.11,60.66 11.73,60.66 9.14,58.06 9.14,30.18 10.06,29.26 SV4.4 | R6.1 34.59,53.65 34.59,56.69 36.27,58.37 39.47,58.37 43.59,54.25 57.61,54.25 58.06,53.8 58.06,48.62 59.59,47.09 59.59,43.28 LED3.K
  Bottom 0.152: R6.1 30.48,47.09 31.39,46.18 31.39,45.26 22.71,36.58 14.94,36.58 10.21,31.85 10.21,29.26 SV4.4
N$27
  Bottom 0.152: R3.1 23.62,57.15 20.12,53.65 12.34,53.65 11.12,52.43 11.12,51.05 6.1,46.02 4.72,46.02 3.5,44.81 3.5,44.04 4.12,43.43 5.49,43.43 6.71,42.22 6.71,41.15 2.59,37.03 2.59,35.66 LED1.A
N$28  (via drill 0.35)
  Top 0.152: U$1.P13 45.72,66.6 v47.4,68.28 | v53.8,69.04 56.69,69.04 SV5.1
  Bottom 0.152: v47.4,68.28 53.03,68.28 v53.8,69.04
N$29
  Top 0.152: U$1.P17 50.75,68.43 55.78,68.43 56.69,67.51 58.52,67.51 59.59,68.58 SV5.2
N$30  (via drill 0.35)
  Top 0.152: v56.39,70.87 50.75,70.87 U$1.P19
  Bottom 0.152: v56.39,70.87 58.67,68.58 58.67,67.06 SV5.4
N$31
  Top 0.152: U$1.P04 39.62,73.3 40.08,73.3 41.45,71.93 41.45,65.23 48.46,58.22 52.88,58.22 57.15,62.48 57.61,62.48 58.22,63.09 58.22,64.92 57.15,65.99 SV5.3
N$32
  Top 0.152: U$1.P03 39.62,74.52 42.06,74.52 49.07,67.51 49.07,65.99 51.51,63.55 57.15,63.55 SV5.5
N$33  (via drill 0.35)
  Top 0.152: v53.8,71.48 53.8,75.29 51.51,77.57 48.92,77.57 47.09,75.74 U$1.P02
  Bottom 0.152: v53.8,71.48 53.8,70.41 57.15,67.06 57.61,67.06 58.67,65.99 58.67,64.47 59.59,63.55 SV5.6
N$34
  Top 0.152: X1.P$8 33.07,3.81 31.85,5.03 SV6.2
N$35
  Top 0.152: X1.P$7 40.54,6.4 33.07,6.4 31.85,7.62 SV6.3
N$36
  Top 0.152: SV6.4 32.92,8.99 40.54,8.99 X1.P$6
N$37
  Top 0.152: X1.P$5 33.07,11.43 31.85,12.65 SV6.5
N$38
  Top 0.152: X1.P$4 40.54,14.02 33.07,14.02 31.85,15.24 SV6.6
N$39
  Top 0.152: SV6.7 32.92,16.61 40.54,16.61 X1.P$3
N$40
  Top 0.152: X1.P$2 33.07,19.05 31.85,20.27 SV6.8
N$41
  Top 0.152: X1.P$1 40.54,21.64 33.07,21.64 31.85,22.86 SV6.9
N$42  (via drill 0.35)
  Top 0.152: 19.51,6.1 19.51,10.52 25.3,16.31 25.3,35.51 C11.+ | 19.51,6.1 19.51,3.81 C12.1 | v76.66,14.94 72.54,10.82 54.71,10.82 49.23,5.33 33.68,5.33 32.92,6.1 19.51,6.1
  Bottom 0.152: v76.66,14.94 89.31,14.94 90.83,16.46 96.47,16.46 IC3.20
N$43
  Bottom 0.152: R4.1 30.48,50.9 31.7,49.68 31.7,25.45 SV6.10
N$44
  Top 0.152: R14.2 45.26,60.96 51.36,54.86 59.44,54.86 70.87,43.43 70.87,13.72 K3.2
N$45
  Bottom 0.152: R6.2 33.07,49.53 33.07,46.94 39.93,40.08 45.72,40.08 60.66,25.15 60.66,13.72 59.74,12.8 K1.2
N$46
  Bottom 0.152: K2.2 59.59,24.23 58.98,24.23 43.43,39.78 37.64,39.78 33.07,44.35 33.07,45.72 R7.2
N$47
  Top 0.152: LED2.A 34.29,38.1 R8.1
N$48
  Top 0.152: R9.1 38.1,41.91 39.32,43.13 57.15,43.13 LED3.A
N$49
  Top 0.152: 39.32,53.34 32,46.02 32,45.87 26.98,40.84 26.98,17.53 24.54,15.09 24.54,7.62 C16.1 | 39.32,53.34 36.88,55.78 36.88,57.15 R13.1 | 39.32,53.34 R12.2
N$50
  Bottom 0.152: IC3.1 88.85,36.88 69.8,36.88 54.25,52.43 37.8,52.43 36.88,53.34 R12.1
N$51
  Top 0.152: R10.1 38.1,45.72 40.54,48.16 57.15,48.16 LED4.A
N$52
  Top 0.152: R11.1 38.1,49.53 39.01,48.62 52.43,48.62 LED5.A
N$53
  Top 0.152: K4.2 69.8,24.23 69.19,24.23 64.31,29.11 38.1,29.11 R15.2
V+
  Top 0.152: C9.+ 17.83,35.51 17.83,29.72 18.75,28.8 18.75,18.75 IC2.IN 5.18,5.18 5.18,2.59 PAD2.1
VDD  (via drill 0.35)
  Top 0.152: v24.38,5.49 24.38,3.81 C13.1 | C1.+ 20.42,17.68 20.42,19.05 L1.1 | C6.+ 10.21,35.51 10.21,34.29 15.24,29.26 SV4.6 v15.24,24.08 | 59.28,14.33 57.76,12.8 57.15,12.8 K1.1 | 59.28,14.33 65.68,14.33 K3.1 | K2.1 57.15,22.25 58.37,21.03 | 58.37,21.03 58.67,20.73 58.67,14.94 59.28,14.33 | 58.37,21.03 59.28,21.95 62.03,21.95 64.16,24.08 67.21,24.08 K4.1 | R11.2 39.47,49.53 40.39,50.44 40.39,53.65 39.47,54.56 39.47,57.15 R13.2 39.32,57.15 38.41,58.06 36.42,58.06 35.81,57.45 35.81,54.41 32,50.6 32,49.68 30.94,48.62 30.02,48.62 29.57,49.07 29.57,54.25 26.98,56.84 26.36,56.84 25.45,55.93 24.23,55.93 C5.1 | R8.2 35.51,41.91 36.42,41 38.41,41 39.32,41.91 R9.2 | SV2.2 C3.1 24.23,64.77 25.15,65.68 27.13,65.68 31.85,60.96 R2.2 | v52.88,71.48 52.88,73.76 51.05,75.59 50.75,75.59 U$1.P23 | CON1.P$7 69.8,55.93 59.59,55.93 57.15,58.37 SV5.9
  Bottom 0.152: 24.38,7.62 24.38,13.72 C1.+ | 24.38,7.62 v24.38,5.49 | 24.38,7.62 IC2.OUT | 7.92,41.6 10.06,39.47 10.06,35.66 C6.+ | 7.92,41.6 IC1.13 | 7.92,41.6 11.73,45.41 13.11,45.41 23.47,55.78 24.08,55.78 C5.1 | v15.24,24.08 20.27,19.05 L1.1 | R8.2 33.07,41.91 33.07,35.66 C14.+ 44.35,24.23 57.15,24.23 K2.1 | 39.47,45.72 39.47,41.91 R9.2 | 39.47,45.72 39.47,49.53 R11.2 | 39.47,45.72 R10.2 | IC3.13 89,6.4 89,7.01 94.94,12.95 94.94,14.33 96.16,15.54 97.54,15.54 98.15,16.15 98.15,35.2 IC3.28 96.47,36.88 90.83,36.88 72.85,54.86 | v52.88,71.48 52.88,70.87 56.08,67.67 56.08,61.87 | 56.08,61.87 56.08,59.59 57.15,58.52 SV5.9 | R2.2 35.51,60.96 36.42,61.87 56.08,61.87 | 72.85,54.86 71.93,55.78 69.95,55.78 CON1.P$7 | R13.2 51.97,57.15 56.84,52.27 70.26,52.27 72.85,54.86